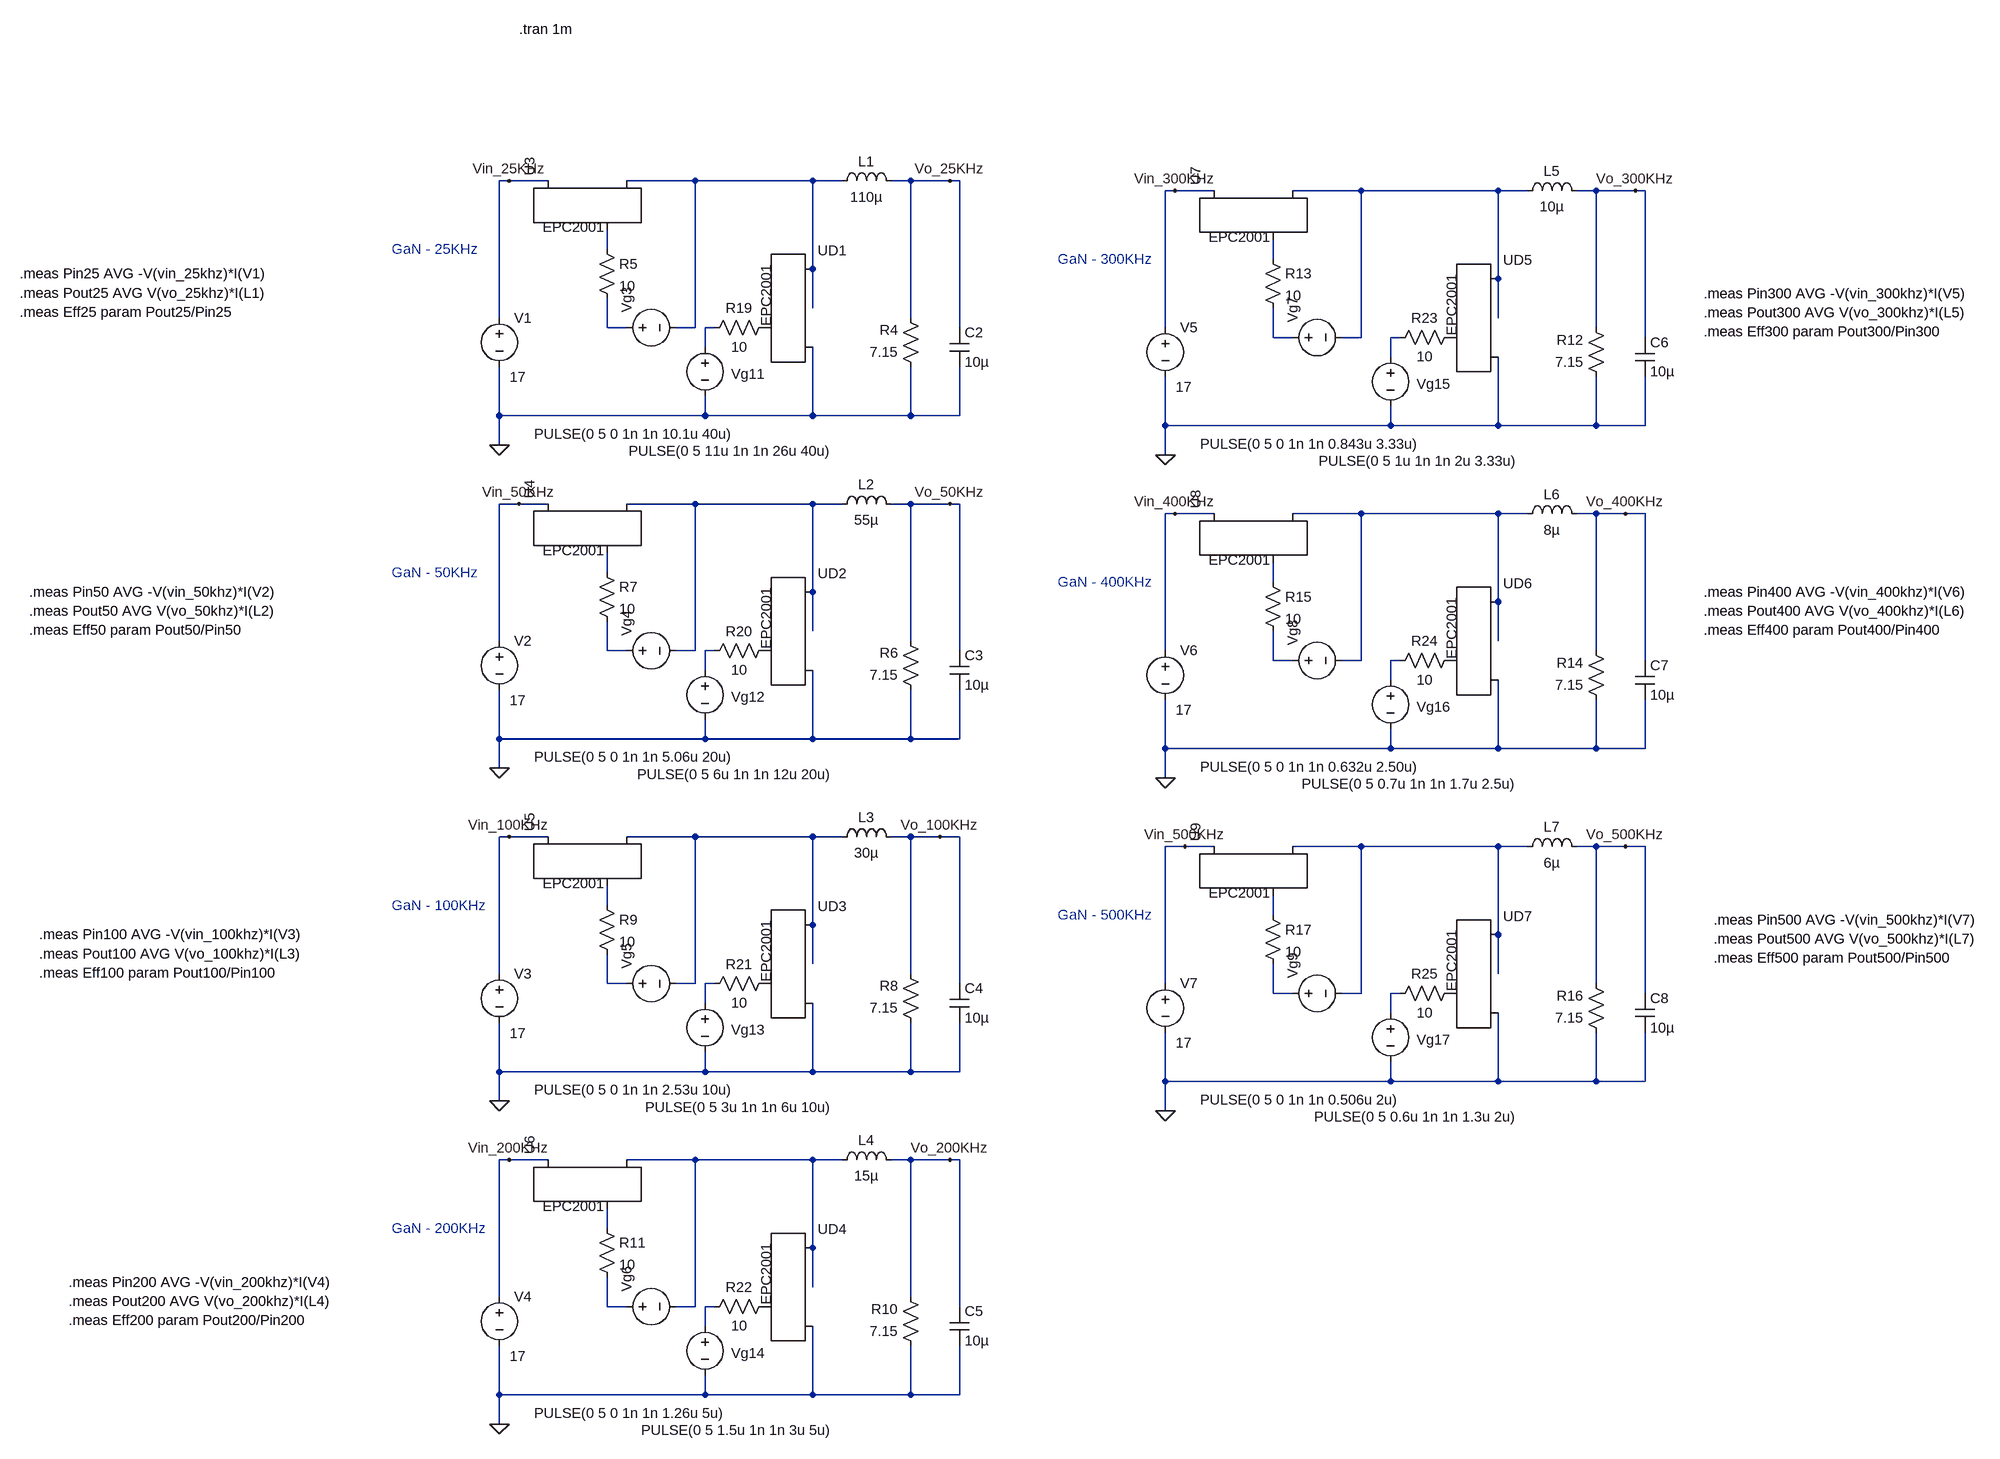
[diagram p0: schematic 2xEPC2001.asc]
2xEPC2001.asc, the LTspice schematic file:
Version 4
SHEET 1 3084 1916
WIRE 640 -144 624 -144
WIRE 704 -144 640 -144
WIRE 944 -144 832 -144
WIRE 1136 -144 944 -144
WIRE 1184 -144 1136 -144
WIRE 1296 -144 1264 -144
WIRE 1360 -144 1296 -144
WIRE 1376 -144 1360 -144
WIRE 1728 -128 1712 -128
WIRE 1792 -128 1728 -128
WIRE 2032 -128 1920 -128
WIRE 2256 -128 2032 -128
WIRE 2304 -128 2256 -128
WIRE 2416 -128 2384 -128
WIRE 2480 -128 2416 -128
WIRE 2496 -128 2480 -128
WIRE 800 -32 800 -64
WIRE 1888 -16 1888 -48
WIRE 1136 0 1136 -144
WIRE 2256 16 2256 -128
WIRE 1136 64 1136 0
WIRE 624 80 624 -144
WIRE 1296 80 1296 -144
WIRE 2256 80 2256 16
WIRE 800 96 800 48
WIRE 832 96 800 96
WIRE 944 96 944 -144
WIRE 944 96 912 96
WIRE 976 96 960 96
WIRE 1376 96 1376 -144
WIRE 1712 96 1712 -128
WIRE 2416 96 2416 -128
WIRE 1888 112 1888 64
WIRE 1920 112 1888 112
WIRE 2032 112 2032 -128
WIRE 2032 112 2000 112
WIRE 2096 112 2080 112
WIRE 2496 112 2496 -128
WIRE 960 128 960 96
WIRE 2080 144 2080 112
WIRE 624 240 624 160
WIRE 960 240 960 208
WIRE 960 240 624 240
WIRE 1136 240 1136 128
WIRE 1136 240 960 240
WIRE 1296 240 1296 160
WIRE 1296 240 1136 240
WIRE 1376 240 1376 160
WIRE 1376 240 1296 240
WIRE 1712 256 1712 176
WIRE 2080 256 2080 224
WIRE 2080 256 1712 256
WIRE 2256 256 2256 144
WIRE 2256 256 2080 256
WIRE 2416 256 2416 176
WIRE 2416 256 2256 256
WIRE 2496 256 2496 176
WIRE 2496 256 2416 256
WIRE 624 288 624 240
WIRE 1712 304 1712 256
WIRE 656 384 624 384
WIRE 704 384 656 384
WIRE 944 384 832 384
WIRE 1136 384 944 384
WIRE 1184 384 1136 384
WIRE 1296 384 1264 384
WIRE 1360 384 1296 384
WIRE 1376 384 1360 384
WIRE 1728 400 1712 400
WIRE 1792 400 1728 400
WIRE 2032 400 1920 400
WIRE 2256 400 2032 400
WIRE 2304 400 2256 400
WIRE 2416 400 2384 400
WIRE 2464 400 2416 400
WIRE 2496 400 2464 400
WIRE 800 496 800 464
WIRE 1888 512 1888 480
WIRE 1136 528 1136 384
WIRE 2256 544 2256 400
WIRE 1136 592 1136 528
WIRE 624 608 624 384
WIRE 1296 608 1296 384
WIRE 2256 608 2256 544
WIRE 800 624 800 576
WIRE 832 624 800 624
WIRE 944 624 944 384
WIRE 944 624 912 624
WIRE 976 624 960 624
WIRE 1376 624 1376 384
WIRE 1712 624 1712 400
WIRE 2416 624 2416 400
WIRE 1888 640 1888 592
WIRE 1920 640 1888 640
WIRE 2032 640 2032 400
WIRE 2032 640 2000 640
WIRE 2096 640 2080 640
WIRE 2496 640 2496 400
WIRE 960 656 960 624
WIRE 2080 672 2080 640
WIRE 624 768 624 688
WIRE 960 768 960 736
WIRE 960 768 624 768
WIRE 1136 768 1136 656
WIRE 1136 768 960 768
WIRE 1296 768 1296 688
WIRE 1296 768 1136 768
WIRE 1376 768 1376 688
WIRE 1376 768 1296 768
WIRE 1712 784 1712 704
WIRE 2080 784 2080 752
WIRE 2080 784 1712 784
WIRE 2256 784 2256 672
WIRE 2256 784 2080 784
WIRE 2416 784 2416 704
WIRE 2416 784 2256 784
WIRE 2496 784 2496 704
WIRE 2496 784 2416 784
WIRE 624 816 624 768
WIRE 1712 832 1712 784
WIRE 640 928 624 928
WIRE 704 928 640 928
WIRE 944 928 832 928
WIRE 1136 928 944 928
WIRE 1184 928 1136 928
WIRE 1296 928 1264 928
WIRE 1344 928 1296 928
WIRE 1376 928 1344 928
WIRE 1744 944 1712 944
WIRE 1792 944 1744 944
WIRE 2032 944 1920 944
WIRE 2256 944 2032 944
WIRE 2304 944 2256 944
WIRE 2416 944 2384 944
WIRE 2464 944 2416 944
WIRE 2496 944 2464 944
WIRE 800 1040 800 1008
WIRE 1888 1056 1888 1024
WIRE 1136 1072 1136 928
WIRE 2256 1088 2256 944
WIRE 1136 1136 1136 1072
WIRE 624 1152 624 928
WIRE 1296 1152 1296 928
WIRE 2256 1152 2256 1088
WIRE 800 1168 800 1120
WIRE 832 1168 800 1168
WIRE 944 1168 944 928
WIRE 944 1168 912 1168
WIRE 976 1168 960 1168
WIRE 1376 1168 1376 928
WIRE 1712 1168 1712 944
WIRE 2416 1168 2416 944
WIRE 1888 1184 1888 1136
WIRE 1920 1184 1888 1184
WIRE 2032 1184 2032 944
WIRE 2032 1184 2000 1184
WIRE 2096 1184 2080 1184
WIRE 2496 1184 2496 944
WIRE 960 1200 960 1168
WIRE 2080 1216 2080 1184
WIRE 624 1312 624 1232
WIRE 960 1312 960 1280
WIRE 960 1312 624 1312
WIRE 1136 1312 1136 1200
WIRE 1136 1312 960 1312
WIRE 1296 1312 1296 1232
WIRE 1296 1312 1136 1312
WIRE 1376 1312 1376 1232
WIRE 1376 1312 1296 1312
WIRE 1712 1328 1712 1248
WIRE 2080 1328 2080 1296
WIRE 2080 1328 1712 1328
WIRE 2256 1328 2256 1216
WIRE 2256 1328 2080 1328
WIRE 2416 1328 2416 1248
WIRE 2416 1328 2256 1328
WIRE 2496 1328 2496 1248
WIRE 2496 1328 2416 1328
WIRE 624 1360 624 1312
WIRE 1712 1376 1712 1328
WIRE 640 1456 624 1456
WIRE 704 1456 640 1456
WIRE 944 1456 832 1456
WIRE 1136 1456 944 1456
WIRE 1184 1456 1136 1456
WIRE 1296 1456 1264 1456
WIRE 1360 1456 1296 1456
WIRE 1376 1456 1360 1456
WIRE 800 1568 800 1536
WIRE 1136 1600 1136 1456
WIRE 1136 1664 1136 1600
WIRE 624 1680 624 1456
WIRE 1296 1680 1296 1456
WIRE 800 1696 800 1648
WIRE 832 1696 800 1696
WIRE 944 1696 944 1456
WIRE 944 1696 912 1696
WIRE 976 1696 960 1696
WIRE 1376 1696 1376 1456
WIRE 960 1728 960 1696
WIRE 624 1840 624 1760
WIRE 960 1840 960 1808
WIRE 960 1840 624 1840
WIRE 1136 1840 1136 1728
WIRE 1136 1840 960 1840
WIRE 1296 1840 1296 1760
WIRE 1296 1840 1136 1840
WIRE 1376 1840 1376 1760
WIRE 1376 1840 1296 1840
WIRE 624 1888 624 1840
FLAG 624 288 0
FLAG 624 816 0
FLAG 624 1360 0
FLAG 624 1888 0
FLAG 1712 304 0
FLAG 1712 832 0
FLAG 1712 1376 0
FLAG 1360 -144 Vo_25KHz
FLAG 1360 384 Vo_50KHz
FLAG 1344 928 Vo_100KHz
FLAG 1360 1456 Vo_200KHz
FLAG 2464 944 Vo_500KHz
FLAG 2464 400 Vo_400KHz
FLAG 2480 -128 Vo_300KHz
FLAG 640 -144 Vin_25KHz
FLAG 656 384 Vin_50KHz
FLAG 640 928 Vin_100KHz
FLAG 640 1456 Vin_200KHz
FLAG 1728 -128 Vin_300KHz
FLAG 1728 400 Vin_400KHz
FLAG 1744 944 Vin_500KHz
SYMBOL voltage 816 96 R270
WINDOW 3 -174 -135 VRight 2
WINDOW 123 0 0 Left 2
SYMATTR Value PULSE(0 5 0 1n 1n 10.1u 40u)
SYMATTR SpiceLine Rser=2
SYMATTR InstName Vg3
SYMBOL voltage 624 64 R0
WINDOW 123 0 0 Left 2
WINDOW 3 17 113 Left 2
SYMATTR Value 17
SYMATTR SpiceLine Rser=0
SYMATTR InstName V1
SYMBOL EPCGaN 800 -64 R270
WINDOW 3 4 -105 VRight 2
SYMATTR Value EPC2001
SYMATTR InstName U3
SYMBOL ind 1168 -128 R270
WINDOW 0 32 56 VTop 2
WINDOW 3 5 56 VBottom 2
SYMATTR InstName L1
SYMATTR Value 110µ
SYMBOL res 1312 176 R180
WINDOW 0 36 76 Left 2
WINDOW 3 36 40 Left 2
SYMATTR InstName R4
SYMATTR Value 7.15
SYMBOL cap 1360 96 R0
SYMATTR InstName C2
SYMATTR Value 10µ
SYMBOL res 784 -48 R0
SYMATTR InstName R5
SYMATTR Value 10
SYMBOL voltage 816 624 R270
WINDOW 3 -174 -135 VRight 2
WINDOW 123 0 0 Left 2
SYMATTR Value PULSE(0 5 0 1n 1n 5.06u 20u)
SYMATTR SpiceLine Rser=2
SYMATTR InstName Vg4
SYMBOL voltage 624 592 R0
WINDOW 123 0 0 Left 2
WINDOW 3 17 113 Left 2
SYMATTR Value 17
SYMATTR SpiceLine Rser=0
SYMATTR InstName V2
SYMBOL EPCGaN 800 464 R270
WINDOW 3 4 -105 VRight 2
SYMATTR Value EPC2001
SYMATTR InstName U4
SYMBOL ind 1168 400 R270
WINDOW 0 32 56 VTop 2
WINDOW 3 5 56 VBottom 2
SYMATTR InstName L2
SYMATTR Value 55µ
SYMBOL res 1312 704 R180
WINDOW 0 36 76 Left 2
WINDOW 3 36 40 Left 2
SYMATTR InstName R6
SYMATTR Value 7.15
SYMBOL cap 1360 624 R0
SYMATTR InstName C3
SYMATTR Value 10µ
SYMBOL res 784 480 R0
SYMATTR InstName R7
SYMATTR Value 10
SYMBOL voltage 816 1168 R270
WINDOW 3 -174 -135 VRight 2
WINDOW 123 0 0 Left 2
SYMATTR Value PULSE(0 5 0 1n 1n 2.53u 10u)
SYMATTR SpiceLine Rser=2
SYMATTR InstName Vg5
SYMBOL voltage 624 1136 R0
WINDOW 123 0 0 Left 2
WINDOW 3 17 113 Left 2
SYMATTR Value 17
SYMATTR SpiceLine Rser=0
SYMATTR InstName V3
SYMBOL EPCGaN 800 1008 R270
WINDOW 3 4 -105 VRight 2
SYMATTR Value EPC2001
SYMATTR InstName U5
SYMBOL ind 1168 944 R270
WINDOW 0 32 56 VTop 2
WINDOW 3 5 56 VBottom 2
SYMATTR InstName L3
SYMATTR Value 30µ
SYMBOL res 1312 1248 R180
WINDOW 0 36 76 Left 2
WINDOW 3 36 40 Left 2
SYMATTR InstName R8
SYMATTR Value 7.15
SYMBOL cap 1360 1168 R0
SYMATTR InstName C4
SYMATTR Value 10µ
SYMBOL res 784 1024 R0
SYMATTR InstName R9
SYMATTR Value 10
SYMBOL voltage 816 1696 R270
WINDOW 3 -174 -135 VRight 2
WINDOW 123 0 0 Left 2
SYMATTR Value PULSE(0 5 0 1n 1n 1.26u 5u)
SYMATTR SpiceLine Rser=2
SYMATTR InstName Vg6
SYMBOL voltage 624 1664 R0
WINDOW 123 0 0 Left 2
WINDOW 3 17 113 Left 2
SYMATTR Value 17
SYMATTR SpiceLine Rser=0
SYMATTR InstName V4
SYMBOL EPCGaN 800 1536 R270
WINDOW 3 4 -105 VRight 2
SYMATTR Value EPC2001
SYMATTR InstName U6
SYMBOL ind 1168 1472 R270
WINDOW 0 32 56 VTop 2
WINDOW 3 5 56 VBottom 2
SYMATTR InstName L4
SYMATTR Value 15µ
SYMBOL res 1312 1776 R180
WINDOW 0 36 76 Left 2
WINDOW 3 36 40 Left 2
SYMATTR InstName R10
SYMATTR Value 7.15
SYMBOL cap 1360 1696 R0
SYMATTR InstName C5
SYMATTR Value 10µ
SYMBOL res 784 1552 R0
SYMATTR InstName R11
SYMATTR Value 10
SYMBOL voltage 1904 112 R270
WINDOW 3 -174 -135 VRight 2
WINDOW 123 0 0 Left 2
SYMATTR Value PULSE(0 5 0 1n 1n 0.843u 3.33u)
SYMATTR SpiceLine Rser=2
SYMATTR InstName Vg7
SYMBOL voltage 1712 80 R0
WINDOW 123 0 0 Left 2
WINDOW 3 17 113 Left 2
SYMATTR Value 17
SYMATTR SpiceLine Rser=0
SYMATTR InstName V5
SYMBOL EPCGaN 1888 -48 R270
WINDOW 3 4 -105 VRight 2
SYMATTR Value EPC2001
SYMATTR InstName U7
SYMBOL ind 2288 -112 R270
WINDOW 0 32 56 VTop 2
WINDOW 3 5 56 VBottom 2
SYMATTR InstName L5
SYMATTR Value 10µ
SYMBOL res 2432 192 R180
WINDOW 0 36 76 Left 2
WINDOW 3 36 40 Left 2
SYMATTR InstName R12
SYMATTR Value 7.15
SYMBOL cap 2480 112 R0
SYMATTR InstName C6
SYMATTR Value 10µ
SYMBOL res 1872 -32 R0
SYMATTR InstName R13
SYMATTR Value 10
SYMBOL voltage 1904 640 R270
WINDOW 3 -174 -135 VRight 2
WINDOW 123 0 0 Left 2
SYMATTR Value PULSE(0 5 0 1n 1n 0.632u 2.50u)
SYMATTR SpiceLine Rser=2
SYMATTR InstName Vg8
SYMBOL voltage 1712 608 R0
WINDOW 123 0 0 Left 2
WINDOW 3 17 113 Left 2
SYMATTR Value 17
SYMATTR SpiceLine Rser=0
SYMATTR InstName V6
SYMBOL EPCGaN 1888 480 R270
WINDOW 3 4 -105 VRight 2
SYMATTR Value EPC2001
SYMATTR InstName U8
SYMBOL ind 2288 416 R270
WINDOW 0 32 56 VTop 2
WINDOW 3 5 56 VBottom 2
SYMATTR InstName L6
SYMATTR Value 8µ
SYMBOL res 2432 720 R180
WINDOW 0 36 76 Left 2
WINDOW 3 36 40 Left 2
SYMATTR InstName R14
SYMATTR Value 7.15
SYMBOL cap 2480 640 R0
SYMATTR InstName C7
SYMATTR Value 10µ
SYMBOL res 1872 496 R0
SYMATTR InstName R15
SYMATTR Value 10
SYMBOL voltage 1904 1184 R270
WINDOW 3 -174 -135 VRight 2
WINDOW 123 0 0 Left 2
SYMATTR Value PULSE(0 5 0 1n 1n 0.506u 2u)
SYMATTR SpiceLine Rser=2
SYMATTR InstName Vg9
SYMBOL voltage 1712 1152 R0
WINDOW 123 0 0 Left 2
WINDOW 3 17 113 Left 2
SYMATTR Value 17
SYMATTR SpiceLine Rser=0
SYMATTR InstName V7
SYMBOL EPCGaN 1888 1024 R270
WINDOW 3 4 -105 VRight 2
SYMATTR Value EPC2001
SYMATTR InstName U9
SYMBOL ind 2288 960 R270
WINDOW 0 32 56 VTop 2
WINDOW 3 5 56 VBottom 2
SYMATTR InstName L7
SYMATTR Value 6µ
SYMBOL res 2432 1264 R180
WINDOW 0 36 76 Left 2
WINDOW 3 36 40 Left 2
SYMATTR InstName R16
SYMATTR Value 7.15
SYMBOL cap 2480 1184 R0
SYMATTR InstName C8
SYMATTR Value 10µ
SYMBOL res 1872 1040 R0
SYMATTR InstName R17
SYMATTR Value 10
SYMBOL voltage 960 112 R0
WINDOW 3 213 186 Right 2
WINDOW 123 0 0 Left 2
WINDOW 0 43 60 Left 2
SYMATTR Value PULSE(0 5 11u 1n 1n 26u 40u)
SYMATTR SpiceLine Rser=2
SYMATTR InstName Vg11
SYMBOL EPCGaN 1056 96 R0
WINDOW 3 4 -105 VRight 2
SYMATTR Value EPC2001
SYMATTR InstName UD1
SYMBOL res 1072 80 R90
WINDOW 0 0 56 VBottom 2
WINDOW 3 32 56 VTop 2
SYMATTR InstName R19
SYMATTR Value 10
SYMBOL voltage 960 640 R0
WINDOW 3 213 186 Right 2
WINDOW 123 0 0 Left 2
WINDOW 0 43 60 Left 2
SYMATTR Value PULSE(0 5 6u 1n 1n 12u 20u)
SYMATTR SpiceLine Rser=2
SYMATTR InstName Vg12
SYMBOL EPCGaN 1056 624 R0
WINDOW 3 4 -105 VRight 2
SYMATTR Value EPC2001
SYMATTR InstName UD2
SYMBOL res 1072 608 R90
WINDOW 0 0 56 VBottom 2
WINDOW 3 32 56 VTop 2
SYMATTR InstName R20
SYMATTR Value 10
SYMBOL voltage 960 1184 R0
WINDOW 3 213 186 Right 2
WINDOW 123 0 0 Left 2
WINDOW 0 43 60 Left 2
SYMATTR Value PULSE(0 5 3u 1n 1n 6u 10u)
SYMATTR SpiceLine Rser=2
SYMATTR InstName Vg13
SYMBOL EPCGaN 1056 1168 R0
WINDOW 3 4 -105 VRight 2
SYMATTR Value EPC2001
SYMATTR InstName UD3
SYMBOL res 1072 1152 R90
WINDOW 0 0 56 VBottom 2
WINDOW 3 32 56 VTop 2
SYMATTR InstName R21
SYMATTR Value 10
SYMBOL voltage 960 1712 R0
WINDOW 3 213 186 Right 2
WINDOW 123 0 0 Left 2
WINDOW 0 43 60 Left 2
SYMATTR Value PULSE(0 5 1.5u 1n 1n 3u 5u)
SYMATTR SpiceLine Rser=2
SYMATTR InstName Vg14
SYMBOL EPCGaN 1056 1696 R0
WINDOW 3 4 -105 VRight 2
SYMATTR Value EPC2001
SYMATTR InstName UD4
SYMBOL res 1072 1680 R90
WINDOW 0 0 56 VBottom 2
WINDOW 3 32 56 VTop 2
SYMATTR InstName R22
SYMATTR Value 10
SYMBOL voltage 2080 128 R0
WINDOW 3 213 186 Right 2
WINDOW 123 0 0 Left 2
WINDOW 0 43 60 Left 2
SYMATTR Value PULSE(0 5 1u 1n 1n 2u 3.33u)
SYMATTR SpiceLine Rser=2
SYMATTR InstName Vg15
SYMBOL EPCGaN 2176 112 R0
WINDOW 3 4 -105 VRight 2
SYMATTR Value EPC2001
SYMATTR InstName UD5
SYMBOL res 2192 96 R90
WINDOW 0 0 56 VBottom 2
WINDOW 3 32 56 VTop 2
SYMATTR InstName R23
SYMATTR Value 10
SYMBOL voltage 2080 656 R0
WINDOW 3 213 186 Right 2
WINDOW 123 0 0 Left 2
WINDOW 0 43 60 Left 2
SYMATTR Value PULSE(0 5 0.7u 1n 1n 1.7u 2.5u)
SYMATTR SpiceLine Rser=2
SYMATTR InstName Vg16
SYMBOL EPCGaN 2176 640 R0
WINDOW 3 4 -105 VRight 2
SYMATTR Value EPC2001
SYMATTR InstName UD6
SYMBOL res 2192 624 R90
WINDOW 0 0 56 VBottom 2
WINDOW 3 32 56 VTop 2
SYMATTR InstName R24
SYMATTR Value 10
SYMBOL voltage 2080 1200 R0
WINDOW 3 213 186 Right 2
WINDOW 123 0 0 Left 2
WINDOW 0 43 60 Left 2
SYMATTR Value PULSE(0 5 0.6u 1n 1n 1.3u 2u)
SYMATTR SpiceLine Rser=2
SYMATTR InstName Vg17
SYMBOL EPCGaN 2176 1184 R0
WINDOW 3 4 -105 VRight 2
SYMATTR Value EPC2001
SYMATTR InstName UD7
SYMBOL res 2192 1168 R90
WINDOW 0 0 56 VBottom 2
WINDOW 3 32 56 VTop 2
SYMATTR InstName R25
SYMATTR Value 10
TEXT 656 -392 Left 2 !.tran 1m
TEXT 448 -32 Left 2 ;GaN - 25KHz
TEXT 448 496 Left 2 ;GaN - 50KHz
TEXT 448 1040 Left 2 ;GaN - 100KHz
TEXT 448 1568 Left 2 ;GaN - 200KHz
TEXT 1536 -16 Left 2 ;GaN - 300KHz
TEXT 1536 512 Left 2 ;GaN - 400KHz
TEXT 1536 1056 Left 2 ;GaN - 500KHz
TEXT -160 8 Left 2 !.meas Pin25 AVG -V(vin_25khz)*I(V1)\n.meas Pout25 AVG V(vo_25khz)*I(L1)\n.meas Eff25 param Pout25/Pin25
TEXT -144 528 Left 2 !.meas Pin50 AVG -V(vin_50khz)*I(V2)\n.meas Pout50 AVG V(vo_50khz)*I(L2)\n.meas Eff50 param Pout50/Pin50
TEXT -128 1088 Left 2 !.meas Pin100 AVG -V(vin_100khz)*I(V3)\n.meas Pout100 AVG V(vo_100khz)*I(L3)\n.meas Eff100 param Pout100/Pin100
TEXT -80 1656 Left 2 !.meas Pin200 AVG -V(vin_200khz)*I(V4)\n.meas Pout200 AVG V(vo_200khz)*I(L4)\n.meas Eff200 param Pout200/Pin200
TEXT 2592 40 Left 2 !.meas Pin300 AVG -V(vin_300khz)*I(V5)\n.meas Pout300 AVG V(vo_300khz)*I(L5)\n.meas Eff300 param Pout300/Pin300
TEXT 2592 528 Left 2 !.meas Pin400 AVG -V(vin_400khz)*I(V6)\n.meas Pout400 AVG V(vo_400khz)*I(L6)\n.meas Eff400 param Pout400/Pin400
TEXT 2608 1064 Left 2 !.meas Pin500 AVG -V(vin_500khz)*I(V7)\n.meas Pout500 AVG V(vo_500khz)*I(L7)\n.meas Eff500 param Pout500/Pin500

The netlist it stands for:
* 2xEPC2001.asc
Vg3 N005 N001 PULSE(0 5 0 1n 1n 10.1u 40u) Rser=2
V1 Vin_25KHz 0 17 Rser=0
XU3 N003 Vin_25KHz N001 EPC2001
L1 N001 Vo_25KHz 110µ
R4 0 Vo_25KHz 7.15
C2 Vo_25KHz 0 10µ
R5 N003 N005 10
Vg4 N013 N009 PULSE(0 5 0 1n 1n 5.06u 20u) Rser=2
V2 Vin_50KHz 0 17 Rser=0
XU4 N011 Vin_50KHz N009 EPC2001
L2 N009 Vo_50KHz 55µ
R6 0 Vo_50KHz 7.15
C3 Vo_50KHz 0 10µ
R7 N011 N013 10
Vg5 N021 N017 PULSE(0 5 0 1n 1n 2.53u 10u) Rser=2
V3 Vin_100KHz 0 17 Rser=0
XU5 N019 Vin_100KHz N017 EPC2001
L3 N017 Vo_100KHz 30µ
R8 0 Vo_100KHz 7.15
C4 Vo_100KHz 0 10µ
R9 N019 N021 10
Vg6 N027 N025 PULSE(0 5 0 1n 1n 1.26u 5u) Rser=2
V4 Vin_200KHz 0 17 Rser=0
XU6 N026 Vin_200KHz N025 EPC2001
L4 N025 Vo_200KHz 15µ
R10 0 Vo_200KHz 7.15
C5 Vo_200KHz 0 10µ
R11 N026 N027 10
Vg7 N007 N002 PULSE(0 5 0 1n 1n 0.843u 3.33u) Rser=2
V5 Vin_300KHz 0 17 Rser=0
XU7 N004 Vin_300KHz N002 EPC2001
L5 N002 Vo_300KHz 10µ
R12 0 Vo_300KHz 7.15
C6 Vo_300KHz 0 10µ
R13 N004 N007 10
Vg8 N015 N010 PULSE(0 5 0 1n 1n 0.632u 2.50u) Rser=2
V6 Vin_400KHz 0 17 Rser=0
XU8 N012 Vin_400KHz N010 EPC2001
L6 N010 Vo_400KHz 8µ
R14 0 Vo_400KHz 7.15
C7 Vo_400KHz 0 10µ
R15 N012 N015 10
Vg9 N023 N018 PULSE(0 5 0 1n 1n 0.506u 2u) Rser=2
V7 Vin_500KHz 0 17 Rser=0
XU9 N020 Vin_500KHz N018 EPC2001
L7 N018 Vo_500KHz 6µ
R16 0 Vo_500KHz 7.15
C8 Vo_500KHz 0 10µ
R17 N020 N023 10
Vg11 N006 0 PULSE(0 5 11u 1n 1n 26u 40u) Rser=2
XUD1 P001 N001 0 EPC2001
R19 P001 N006 10
Vg12 N014 0 PULSE(0 5 6u 1n 1n 12u 20u) Rser=2
XUD2 P002 N009 0 EPC2001
R20 P002 N014 10
Vg13 N022 0 PULSE(0 5 3u 1n 1n 6u 10u) Rser=2
XUD3 P003 N017 0 EPC2001
R21 P003 N022 10
Vg14 N028 0 PULSE(0 5 1.5u 1n 1n 3u 5u) Rser=2
XUD4 P004 N025 0 EPC2001
R22 P004 N028 10
Vg15 N008 0 PULSE(0 5 1u 1n 1n 2u 3.33u) Rser=2
XUD5 P005 N002 0 EPC2001
R23 P005 N008 10
Vg16 N016 0 PULSE(0 5 0.7u 1n 1n 1.7u 2.5u) Rser=2
XUD6 P006 N010 0 EPC2001
R24 P006 N016 10
Vg17 N024 0 PULSE(0 5 0.6u 1n 1n 1.3u 2u) Rser=2
XUD7 P007 N018 0 EPC2001
R25 P007 N024 10
.tran 1m
* GaN - 25KHz
* GaN - 50KHz
* GaN - 100KHz
* GaN - 200KHz
* GaN - 300KHz
* GaN - 400KHz
* GaN - 500KHz
.meas Pin25 AVG -V(vin_25khz)*I(V1)
.meas Pout25 AVG V(vo_25khz)*I(L1)
.meas Eff25 param Pout25/Pin25
.meas Pin50 AVG -V(vin_50khz)*I(V2)
.meas Pout50 AVG V(vo_50khz)*I(L2)
.meas Eff50 param Pout50/Pin50
.meas Pin100 AVG -V(vin_100khz)*I(V3)
.meas Pout100 AVG V(vo_100khz)*I(L3)
.meas Eff100 param Pout100/Pin100
.meas Pin200 AVG -V(vin_200khz)*I(V4)
.meas Pout200 AVG V(vo_200khz)*I(L4)
.meas Eff200 param Pout200/Pin200
.meas Pin300 AVG -V(vin_300khz)*I(V5)
.meas Pout300 AVG V(vo_300khz)*I(L5)
.meas Eff300 param Pout300/Pin300
.meas Pin400 AVG -V(vin_400khz)*I(V6)
.meas Pout400 AVG V(vo_400khz)*I(L6)
.meas Eff400 param Pout400/Pin400
.meas Pin500 AVG -V(vin_500khz)*I(V7)
.meas Pout500 AVG V(vo_500khz)*I(L7)
.meas Eff500 param Pout500/Pin500
.backanno
.end